# EAGLE schematic LEDDriver_v_1 (EAGLE 6.4)
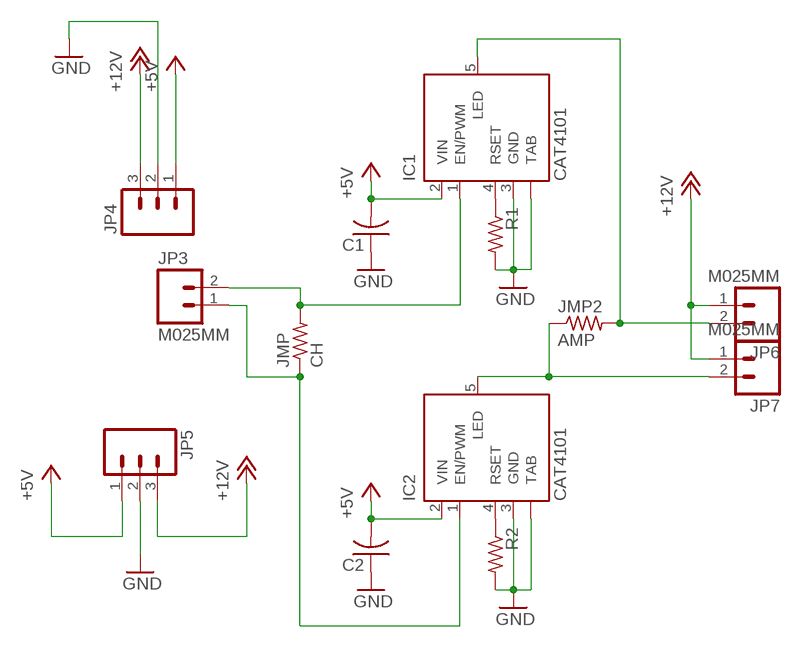
[diagram p0: schematic, sheet 1]

## Parts
C1  C-USC1206  [C1206]
C2  C-USC1206  [C1206]
IC1  CAT4101  [TO263_5]
IC2  CAT4101  [TO263_5]
JMP  CH  R-US_R1206  [R1206]
JMP2  AMP  R-US_R1206  [R1206]
JP3  M025MM  [SCREWTERMINAL-5MM-2]
JP4  M03-SCREW-5MM  [SCREWTERMINAL-5MM-3]
JP5  M03-SCREW-5MM  [SCREWTERMINAL-5MM-3]
JP6  M025MM  [SCREWTERMINAL-5MM-2]
JP7  M025MM  [SCREWTERMINAL-5MM-2]
R1  R-US_R1206  [R1206]
R2  R-US_R1206  [R1206]

## Nets
+5V: C1.2 C2.2 IC1.2(VIN) IC2.2(VIN) JP4.1 JP5.1
+12V: JP4.3 JP5.3 JP6.1 JP7.1
GND: C1.1 C2.1 IC1.3(GND) IC1.TAB IC2.3(GND) IC2.TAB JP4.2 JP5.2 R1.2 R2.2
N$1: IC1.1(EN/PWM) JMP.2 JP3.2
N$2: IC2.1(EN/PWM) JMP.1 JP3.1
N$3: IC1.4(RSET) R1.1
N$4: IC2.5(LED) JMP2.1 JP7.2
N$5: IC1.5(LED) JMP2.2 JP6.2
N$8: IC2.4(RSET) R2.1

## Library data of the parts
C1 C2 = adafruit:C-US: CAPACITOR, American symbol
IC1 IC2 = on-semiconductor:CAT4101: 1A Constant-Current LED Driver with PWM Dimming Source: ON Semiconductor .. 4101.pdf; MPN: CAT4101TV-T75; OC_FARNELL: 1718452; OC_NEWARK: 08R5264
JMP JMP2 R1 R2 = adafruit:R-US_: RESISTOR, American symbol
JP3 JP6 JP7 = SparkFun-Connectors:M02: Standard 2-pin 0.1" header. Use with - straight break away headers ( PRT-00116) - right angle break away headers (PRT-00553) - swiss pins (PRT-00743) - machine pins (PRT-00117) - female headers (PRT-00115) Molex polarized connector foot print use with: PRT-08233 with associated crimp pins and housings. 2.54_SCREWTERM for use with PRT-10571. 3.5mm Screw Terminal footprints for PRT-08084 5mm Screw Terminal footprints for use with PRT-08433
JP4 JP5 = SparkFun-Connectors:M03: Header 3 Standard 3-pin 0.1" header. Use with straight break away headers (SKU : PRT-00116), right angle break away headers (PRT-00553), swiss pins (PRT-00743), machine pins (PRT-00117), and female headers (PRT-00115). Molex polarized connector foot print use with SKU : PRT-08232 with associated crimp pins and housings.